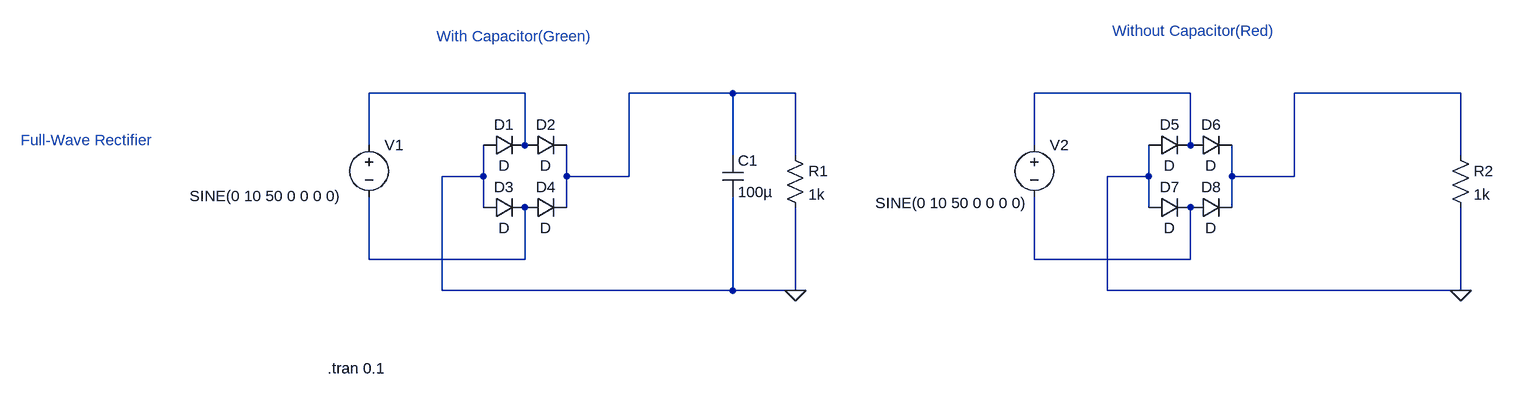
[diagram p0: schematic Full-WaveRectifier.asc]
Full-WaveRectifier.asc, the LTspice schematic file:
Version 4.1
SHEET 1 1560 680
WIRE 64 128 -176 128
WIRE 384 128 224 128
WIRE 480 128 384 128
WIRE 1088 128 848 128
WIRE 1504 128 1248 128
WIRE -176 208 -176 128
WIRE 64 208 64 128
WIRE 848 208 848 128
WIRE 1088 208 1088 128
WIRE 384 224 384 128
WIRE 480 224 480 128
WIRE 1504 224 1504 128
WIRE 0 256 0 208
WIRE 0 256 -64 256
WIRE 128 256 128 208
WIRE 224 256 224 128
WIRE 224 256 128 256
WIRE 1024 256 1024 208
WIRE 1024 256 960 256
WIRE 1152 256 1152 208
WIRE 1248 256 1248 128
WIRE 1248 256 1152 256
WIRE 0 304 0 256
WIRE 128 304 128 256
WIRE 1024 304 1024 256
WIRE 1152 304 1152 256
WIRE -176 384 -176 288
WIRE 64 384 64 304
WIRE 64 384 -176 384
WIRE 848 384 848 288
WIRE 1088 384 1088 304
WIRE 1088 384 848 384
WIRE -64 432 -64 256
WIRE 384 432 384 288
WIRE 384 432 -64 432
WIRE 480 432 480 304
WIRE 480 432 384 432
WIRE 960 432 960 256
WIRE 1504 432 1504 304
WIRE 1504 432 960 432
FLAG 480 432 0
FLAG 1504 432 0
SYMBOL diode 0 224 R270
WINDOW 0 32 32 VTop 2
WINDOW 3 0 32 VBottom 2
SYMATTR InstName D1
SYMBOL diode 64 224 R270
WINDOW 0 32 32 VTop 2
WINDOW 3 0 32 VBottom 2
SYMATTR InstName D2
SYMBOL diode 0 320 R270
WINDOW 0 32 32 VTop 2
WINDOW 3 0 32 VBottom 2
SYMATTR InstName D3
SYMBOL diode 64 320 R270
WINDOW 0 32 32 VTop 2
WINDOW 3 0 32 VBottom 2
SYMATTR InstName D4
SYMBOL voltage -176 192 R0
WINDOW 3 -276 94 Left 2
WINDOW 123 0 0 Left 0
WINDOW 39 0 0 Left 0
SYMATTR InstName V1
SYMATTR Value SINE(0 10 50 0 0 0 0)
SYMBOL res 464 208 R0
SYMATTR InstName R1
SYMATTR Value 1k
SYMBOL cap 368 224 R0
SYMATTR InstName C1
SYMATTR Value 100µ
SYMBOL diode 1024 224 R270
WINDOW 0 32 32 VTop 2
WINDOW 3 0 32 VBottom 2
SYMATTR InstName D5
SYMBOL diode 1088 224 R270
WINDOW 0 32 32 VTop 2
WINDOW 3 0 32 VBottom 2
SYMATTR InstName D6
SYMBOL diode 1024 320 R270
WINDOW 0 32 32 VTop 2
WINDOW 3 0 32 VBottom 2
SYMATTR InstName D7
SYMBOL diode 1088 320 R270
WINDOW 0 32 32 VTop 2
WINDOW 3 0 32 VBottom 2
SYMATTR InstName D8
SYMBOL voltage 848 192 R0
WINDOW 3 -245 105 Left 2
WINDOW 123 0 0 Left 0
WINDOW 39 0 0 Left 0
SYMATTR InstName V2
SYMATTR Value SINE(0 10 50 0 0 0 0)
SYMBOL res 1488 208 R0
SYMATTR InstName R2
SYMATTR Value 1k
TEXT -72 40 Left 2 ;With Capacitor(Green)
TEXT 968 32 Left 2 ;Without Capacitor(Red)
TEXT -712 200 Left 2 ;Full-Wave Rectifier
TEXT -240 552 Left 2 !.tran 0.1

The netlist it stands for:
* Full-WaveRectifier.asc
D1 0 N001 D
D2 N001 N002 D
D3 0 N005 D
D4 N005 N002 D
V1 N001 N005 SINE(0 10 50 0 0 0 0)
R1 N002 0 1k
C1 N002 0 100µ
D5 0 N003 D
D6 N003 N004 D
D7 0 N006 D
D8 N006 N004 D
V2 N003 N006 SINE(0 10 50 0 0 0 0)
R2 N004 0 1k
.model D D
.lib standard.dio
* With Capacitor(Green)
* Without Capacitor(Red)
* Full-Wave Rectifier
.tran 0.1
.backanno
.end